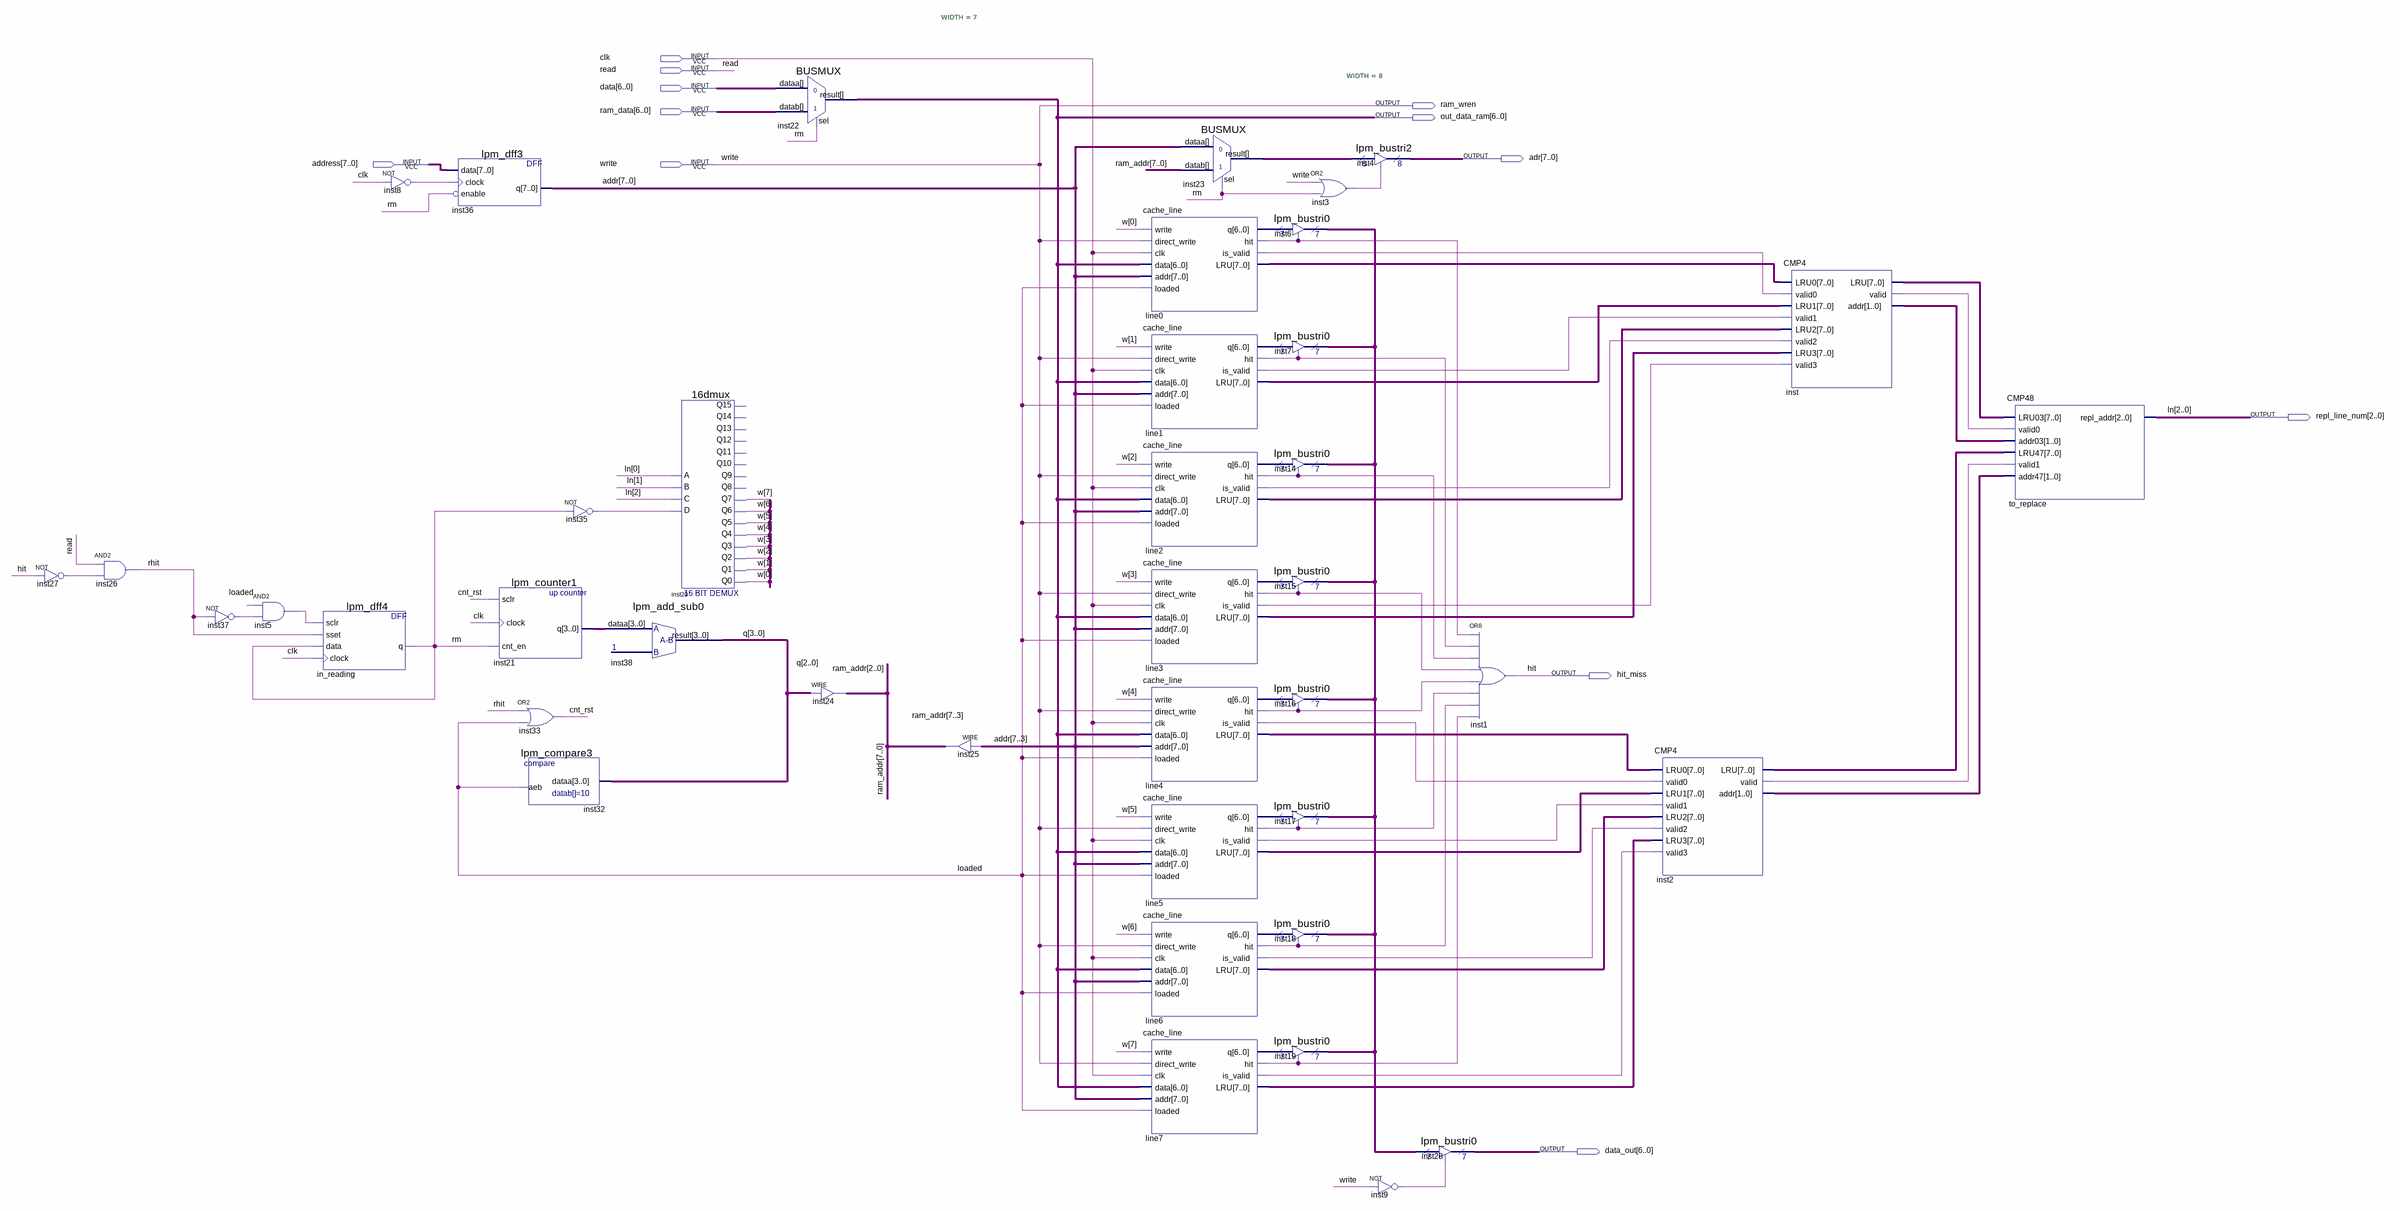
[diagram p0: schematic sheet]
// Quartus schematic Cache.bdf as structural Verilog: 41 symbols, 12 pins
module Cache (
  input  clk,
  input  read,
  input  [6:0] data,
  input  [6:0] ram_data,
  input  [7:0] address,
  input  write,
  output ram_wren,
  output [6:0] out_data_ram,
  output [7:0] adr,
  output [2:0] repl_line_num,
  output hit_miss,
  output [6:0] data_out
);

  wire cnt_rst, inst2_valid, inst3_out, inst5_out, inst8_out, inst9_out, inst27_out, inst35_out, inst37_out,
       inst_valid, line0_hit, line0_is_valid, line1_hit, line1_is_valid, line2_hit, line2_is_valid,
       line3_hit, line3_is_valid, line4_hit, line4_is_valid, line5_hit, line5_is_valid, line6_hit,
       line6_is_valid, line7_hit, line7_is_valid, loaded, rhit, rm;
  wire [1:0] inst2_addr, inst_addr;
  wire [3:0] inst21_q, q;
  wire [6:0] inst6_tridata, line0_q, line1_q, line2_q, line3_q, line4_q, line5_q, line6_q, line7_q;
  wire [7:0] addr, inst2_lru, inst23_result, inst_lru, line0_lru, line1_lru, line2_lru, line3_lru, line4_lru,
       line5_lru, line6_lru, line7_lru, ram_addr, w;

  not inst27 (inst27_out, hit_miss);
  and inst26 (rhit, read, inst27_out);
  not inst37 (inst37_out, rhit);
  and inst5 (inst5_out, loaded, inst37_out);
  lpm_dff4 in_reading (.sclr(inst5_out), .sset(rhit), .data(rm), .clock(clk), .q(rm));
  not inst8 (inst8_out, clk);
  lpm_dff3 inst36 (.data(address), .clock(inst8_out), .enable(~rm), .q(addr));
  lpm_counter1 inst21 (.sclr(cnt_rst), .clock(clk), .cnt_en(rm), .q(inst21_q));
  or inst33 (cnt_rst, rhit, loaded);
  lpm_compare3 inst32 (.dataa(q), .aeb(loaded));
  not inst35 (inst35_out, rm);
  lpm_add_sub0 inst38 (.dataa(inst21_q), .result(q));
  \16dmux  inst20 (
    .C(repl_line_num[2]), .B(repl_line_num[1]), .A(repl_line_num[0]), .D(inst35_out), .Q7(w[7]), .Q4(w[4]),
    .Q5(w[5]), .Q6(w[6]), .Q2(w[2]), .Q3(w[3]), .Q0(w[0]), .Q1(w[1]));  // open: Q12, Q13, Q11, Q9, Q10, Q8, Q14, Q15
  BUSMUX #(.WIDTH(7)) inst22 (.datab(ram_data), .sel(rm), .dataa(data), .result(out_data_ram));
  assign ram_addr[2:0] = q[2:0];  // WIRE inst24
  assign ram_addr[7:3] = addr[7:3];  // WIRE inst25
  cache_line line0 (
    .write(w[0]), .direct_write(write), .clk(clk), .data(out_data_ram), .addr(addr), .loaded(loaded),
    .q(line0_q), .hit(line0_hit), .is_valid(line0_is_valid), .LRU(line0_lru));
  cache_line line1 (
    .write(w[1]), .direct_write(write), .clk(clk), .data(out_data_ram), .addr(addr), .loaded(loaded),
    .q(line1_q), .hit(line1_hit), .is_valid(line1_is_valid), .LRU(line1_lru));
  cache_line line2 (
    .write(w[2]), .direct_write(write), .clk(clk), .data(out_data_ram), .addr(addr), .loaded(loaded),
    .q(line2_q), .hit(line2_hit), .is_valid(line2_is_valid), .LRU(line2_lru));
  cache_line line3 (
    .write(w[3]), .direct_write(write), .clk(clk), .data(out_data_ram), .addr(addr), .loaded(loaded),
    .q(line3_q), .hit(line3_hit), .is_valid(line3_is_valid), .LRU(line3_lru));
  cache_line line4 (
    .write(w[4]), .direct_write(write), .clk(clk), .data(out_data_ram), .addr(addr), .loaded(loaded),
    .q(line4_q), .hit(line4_hit), .is_valid(line4_is_valid), .LRU(line4_lru));
  cache_line line5 (
    .write(w[5]), .direct_write(write), .clk(clk), .data(out_data_ram), .addr(addr), .loaded(loaded),
    .q(line5_q), .hit(line5_hit), .is_valid(line5_is_valid), .LRU(line5_lru));
  cache_line line6 (
    .write(w[6]), .direct_write(write), .clk(clk), .data(out_data_ram), .addr(addr), .loaded(loaded),
    .q(line6_q), .hit(line6_hit), .is_valid(line6_is_valid), .LRU(line6_lru));
  cache_line line7 (
    .write(w[7]), .direct_write(write), .clk(clk), .data(out_data_ram), .addr(addr), .loaded(loaded),
    .q(line7_q), .hit(line7_hit), .is_valid(line7_is_valid), .LRU(line7_lru));
  BUSMUX #(.WIDTH(8)) inst23 (.datab(ram_addr), .sel(rm), .dataa(addr), .result(inst23_result));
  lpm_bustri0 inst6 (.enabledt(line0_hit), .data(line0_q), .tridata(inst6_tridata));
  lpm_bustri0 inst7 (.enabledt(line1_hit), .data(line1_q), .tridata(inst6_tridata));
  lpm_bustri0 inst14 (.enabledt(line2_hit), .data(line2_q), .tridata(inst6_tridata));
  lpm_bustri0 inst15 (.enabledt(line3_hit), .data(line3_q), .tridata(inst6_tridata));
  lpm_bustri0 inst16 (.enabledt(line4_hit), .data(line4_q), .tridata(inst6_tridata));
  lpm_bustri0 inst17 (.enabledt(line5_hit), .data(line5_q), .tridata(inst6_tridata));
  lpm_bustri0 inst18 (.enabledt(line6_hit), .data(line6_q), .tridata(inst6_tridata));
  lpm_bustri0 inst19 (.enabledt(line7_hit), .data(line7_q), .tridata(inst6_tridata));
  or inst3 (inst3_out, write, rm);
  lpm_bustri2 inst4 (.enabledt(inst3_out), .data(inst23_result), .tridata(adr));
  not inst9 (inst9_out, write);
  lpm_bustri0 inst28 (.enabledt(inst9_out), .data(inst6_tridata), .tridata(data_out));
  or inst1 (hit_miss, line0_hit, line1_hit, line2_hit, line3_hit, line4_hit, line5_hit, line6_hit, line7_hit);
  CMP4 inst2 (
    .LRU0(line4_lru), .valid0(line4_is_valid), .LRU1(line5_lru), .valid1(line5_is_valid), .LRU2(line6_lru),
    .valid2(line6_is_valid), .LRU3(line7_lru), .valid3(line7_is_valid), .LRU(inst2_lru), .valid(inst2_valid),
    .addr(inst2_addr));
  CMP4 inst (
    .LRU0(line0_lru), .valid0(line0_is_valid), .LRU1(line1_lru), .valid1(line1_is_valid), .LRU2(line2_lru),
    .valid2(line2_is_valid), .LRU3(line3_lru), .valid3(line3_is_valid), .LRU(inst_lru), .valid(inst_valid),
    .addr(inst_addr));
  CMP48 to_replace (
    .LRU03(inst_lru), .valid0(inst_valid), .addr03(inst_addr), .LRU47(inst2_lru), .valid1(inst2_valid),
    .addr47(inst2_addr), .repl_addr(repl_line_num));

  assign ram_wren = write;

  // Other names for the same wires on the sheet: hit = hit_miss; ln[2:0] = repl_line_num
endmodule
